# Altium schematic sheet MultiRotor.SchDoc
size A4
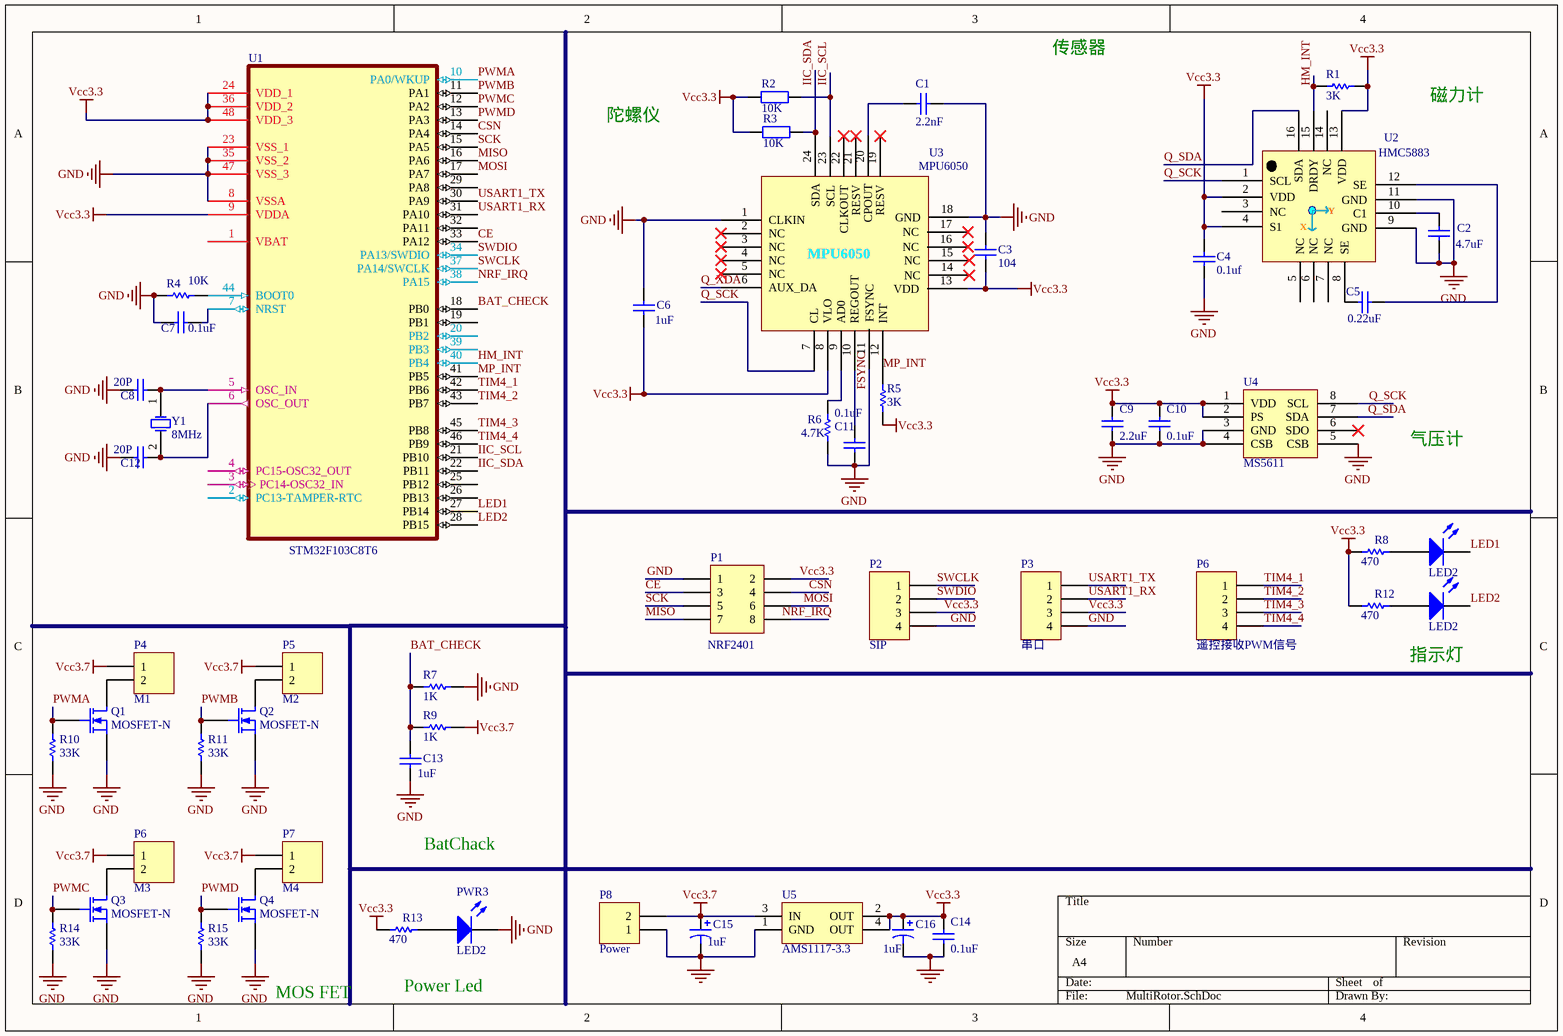
[diagram p0: MultiRotor.SchDoc]

## Parts
(Parts that share a designator on the sheet are numbered #1, #2 ... from top to bottom, then left to right.)
C1  value 2.2nF  [CAP[0805]]  (hidden comment: Cap)
C2  value 4.7uF  [CAP[0805]]  (hidden comment: Cap)
C3  value 104  [CAP[0805]]  (hidden comment: Cap)
C4  value 0.1uf  [CAP[0805]]  (hidden comment: Cap)
C5  value 0.22uF  [CAP[0805]]  (hidden comment: Cap)
C6  value 1uF  [CAP[0805]]  (hidden comment: Cap)
C7  value 0.1uF  [RAD-0.3]  (hidden comment: Cap)
C8  value 20P  [RAD-0.3]  (hidden comment: Cap)
C9  value 2.2uF  [CAP[0805]]  (hidden comment: Cap)
C10  value 0.1uF  [CAP[0805]]  (hidden comment: Cap)
C11  value 0.1uF  [CAP[0805]]  (hidden comment: Cap)
C12  value 20P  [RAD-0.3]  (hidden comment: Cap)
C13  value 1uF  [RAD-0.3]  (hidden comment: Cap)
C14  value 0.1uF  [RAD-0.3]  (hidden comment: Cap)
C15  value 1uF  [RB7.6-15]  (hidden comment: Cap Pol1)
C16  value 1uF  [RB7.6-15]  (hidden comment: Cap Pol1)
P1  NRF2401  [H2.54-2X4]
P2  SIP  [H2.54-1X4]
P3  串口  [H2.54-1X4]
P4  M1  [HDR1X2]
P5  M2  [HDR1X2]
P6#1  遥控接收PWM信号  [H2.54-1X4]
P6#2  M3  [HDR1X2]
P7  M4  [HDR1X2]
P8  Power  [H2.54-1X2]
PWR1  LED2  [3.2X1.6X1.1]
PWR2  LED2  [3.2X1.6X1.1]
PWR3  LED2  [3.2X1.6X1.1]
Q1  MOSFET-N  [E3]
Q2  MOSFET-N  [E3]
Q3  MOSFET-N  [E3]
Q4  MOSFET-N  [E3]
R1  value 3K  [AXIAL-0.3]  (hidden comment: Res1)
R2  value 10K  [CAP[0805]]  (hidden comment: Res2)
R3  value 10K  [CAP[0805]]  (hidden comment: Res2)
R4  value 10K  [AXIAL-0.3]  (hidden comment: Res1)
R5  value 3K  [AXIAL-0.3]  (hidden comment: Res1)
R6  value 4.7K  [AXIAL-0.3]  (hidden comment: Res1)
R7  value 1K  [AXIAL-0.3]  (hidden comment: Res1)
R8  value 470  [AXIAL-0.3]  (hidden comment: Res1)
R9  value 1K  [AXIAL-0.3]  (hidden comment: Res1)
R10  value 33K  [AXIAL-0.3]  (hidden comment: Res1)
R11  value 33K  [AXIAL-0.3]  (hidden comment: Res1)
R12  value 470  [AXIAL-0.3]  (hidden comment: Res1)
R13  value 470  [AXIAL-0.3]  (hidden comment: Res1)
R14  value 33K  [AXIAL-0.3]  (hidden comment: Res1)
R15  value 33K  [AXIAL-0.3]  (hidden comment: Res1)
U1  STM32F103C8T6  [Quad48]
U2  HMC5883
U3  MPU6050
U4  MS5611
U5  AMS1117-3.3  [ZZ311]
Y1  8MHz  [R38]

## Nets
FSYNC: C1.2 C2.2 C3.1 C4.1 C6.2 C7.2 C8.2 C9.1 C10.1 C11.2 C12.2 C13.1 C14.1 C15.2 C16.2 P1.1 P2.4 P3.4 P8.1 PWR3.2(K) Q1.3(S) Q2.3(S) Q3.3(S) Q4.3(S) R4.2 R6.2 R7.1 R10.1 R11.1 R14.1 R15.1 U1.8(VSSA) U1.23(VSS_1) U1.35(VSS_2) U1.47(VSS_3) U2.9(GND) U2.11(GND) U3.1(CLKIN) U3.11(FSYNC) U3.18(GND) U4.3(GND) U4.4(CSB) U4.5(CSB) U5.1(GND)  [also labelled GND]
Vcc3.3: C3.2 C4.2 C6.1 C9.2 C10.2 C14.2 C16.1 P1.2 P2.3 P3.3 R1.1 R2.2 R3.2 R5.1 R8.2 R12.2 R13.2 U1.9(VDDA) U1.24(VDD_1) U1.36(VDD_2) U1.48(VDD_3) U2.2(VDD) U2.4(S1) U2.13(VDD) U3.8(VLO) U3.13(VDD) U4.1(VDD) U4.2(PS) U5.2(OUT) U5.4(OUT)
Vcc3.7: C15.1 P4.1 P5.1 P6#2.1 P7.1 P8.2 R9.1 U5.3(IN)
BAT_CHECK: C13.2 R7.2 R9.2 U1.18(PB0)
CE: P1.3 U1.33(PA12)
CSN: P1.4 U1.14(PA4)
HM_INT: R1.2 U1.40(PB4) U2.15(DRDY)
IIC_SCL: R2.1 U1.21(PB10) U3.23(SCL)
IIC_SDA: R3.1 U1.22(PB11) U3.24(SDA)
LED1: PWR1.2(K) U1.27(PB14)
LED2: PWR2.2(K) U1.28(PB15)
MISO: P1.7 U1.16(PA6)
MOSI: P1.6 U1.17(PA7)
MP_INT: R5.2 U1.41(PB5) U3.12(INT)
NRF_IRQ: U1.38(PA15)
PWMA: Q1.2(G) R10.2 U1.10(PA0/WKUP)
PWMB: Q2.2(G) R11.2 U1.11(PA1)
PWMC: Q3.2(G) R14.2 U1.12(PA2)
PWMD: Q4.2(G) R15.2 U1.13(PA3)
Q_SCK: U2.1(SCL) U3.7(CL) U4.8(SCL)
Q_SDA: U2.16(SDA) U4.7(SDA)
Q_XDA: U3.6(AUX_DA)
SCK: P1.5 U1.15(PA5)
SWCLK: P2.1 U1.37(PA14/SWCLK)
SWDIO: P2.2 U1.34(PA13/SWDIO)
TIM4_1: P6#1.1 U1.42(PB6)
TIM4_2: P6#1.2 U1.43(PB7)
TIM4_3: P6#1.3 U1.45(PB8)
TIM4_4: P6#1.4 U1.46(PB9)
USART1_RX: P3.2 U1.31(PA10)
USART1_TX: P3.1 U1.30(PA9)
NetC1_1: C1.1 U3.20(CPOUT)
NetC2_1: C2.1 U2.10(C1)
NetC5_1: C5.1 U2.8(SE)
NetC5_2: C5.2 U2.12(SE)
NetC7_1: C7.1 U1.7(NRST)
NetC8_1: C8.1 U1.5(OSC_IN) Y1.1(OSC1)
NetC11_1: C11.1 U3.10(REGOUT)
NetC12_1: C12.1 U1.6(OSC_OUT) Y1.2(OSC2)
NetP4_2: P4.2 Q1.1(D)
NetP5_2: P5.2 Q2.1(D)
NetP6#2_2: P6#2.2 Q3.1(D)
NetP7_2: P7.2 Q4.1(D)
NetPWR1_1: PWR1.1(A) R8.1
NetPWR2_1: PWR2.1(A) R12.1
NetPWR3_1: PWR3.1(A) R13.1
NetR4_1: R4.1 U1.44(BOOT0)
NetR6_1: R6.1 U3.9(AD0)

Not connected (* = marked no-connect by the designer): P1 8; U1 1(VBAT) 2(PC13-TAMPER-RTC) 3(PC14-OSC32_IN) 4(PC15-OSC32_OUT) 19(PB1) 20(PB2) 25(PB12) 26(PB13) 29(PA8) 32(PA11) 39(PB3); U2 3(NC) 5(NC) 6(NC) 7(NC) 14(NC); U3 2(NC)* 3(NC)* 4(NC)* 5(NC)* 14(NC)* 15(NC)* 16(NC)* 17(NC)* 19(RESV)* 21(RESV)* 22(CLKOUT)*; U4 6(SDO)*

## Notes on the sheet
- 传感器
- 磁力计
- 陀螺仪
- 气压计
- 指示灯
- BatChack
- MOS FET
- Power Led
- Labels drawn without touching a wire or pin: NRF_IRQ
- (in symbol HMC5883) Y; X

## Library data of the parts
C1-C14 = Cap: Capacitor; Published: 8-Jun-2000; LatestRevisionDate: 17-Jul-2002; LatestRevisionNote: Re-released for DXP Platform.; Publisher: Altium Limited
  C1-C6 C9-C11: PackageReference: RAD-0.3
  C7 C8 C12 C13: PackageReference: RAD-0.3; PackageDescription: Radial Cap, Thru-Hole; 2 Leads; 0.3 in Pin Spacing
C15 C16 = Cap Pol1: Polarized Capacitor (Radial); Published: 8-Jun-2000; LatestRevisionDate: 17-Jul-2002; LatestRevisionNote: Re-released for DXP Platform.; Publisher: Altium Limited
P1 = Header 4X2: Header, 4-Pin, Dual row; LatestRevisionDate: 17-Jul-2002; LatestRevisionNote: Re-released for DXP Platform.; Publisher: Altium Limited
P2 P3 P6#1 = Header 4: Header, 4-Pin; LatestRevisionDate: 17-Jul-2002; LatestRevisionNote: Re-released for DXP Platform.; Publisher: Altium Limited
P4 P5 P6#2 P7 P8 = Header 2: Header, 2-Pin; LatestRevisionDate: 17-Jul-2002; LatestRevisionNote: Re-released for DXP Platform.; Publisher: Altium Limited
PWR1-PWR3 = LED2: Typical RED, GREEN, YELLOW, AMBER GaAs LED; Published: 8-Jun-2000; LatestRevisionDate: 17-Jul-2002; LatestRevisionNote: Re-released for DXP Platform.; PackageVersion: Feb-2002; PackageReference: 3.2X1.6X1.1; Publisher: Altium Limited; PackageDescription: SM LED; 2 Flat Leads
Q1-Q4 = MOSFET-N: N-Channel MOSFET; Published: 8-Jun-2000; LatestRevisionDate: 17-Jul-2002; LatestRevisionNote: Re-released for DXP Platform.; PackageVersion: 1995/1996; PackageReference: E3; Publisher: Altium Limited; PackageDescription: TO, Flat Index; 3 In-Line, Axial Leads; Body Dia. 4.6mm; Lead Dia. 0.5 mm (max)
R1 R4-R15 = Res1: Resistor; Published: 8-Jun-2000; LatestRevisionDate: 17-Jul-2002; LatestRevisionNote: Re-released for DXP Platform.; PackageReference: AXIAL-0.3; Publisher: Altium Limited; PackageDescription: Axial Device, Thru-Hole; 2 Leads; 0.3 in Pin Spacing
R2 R3 = Res2: Resistor; Published: 8-Jun-2000; LatestRevisionDate: 17-Jul-2002; LatestRevisionNote: Re-released for DXP Platform.; PackageReference: AXIAL-0.4; Publisher: Altium Limited
U1 = STM32F103C8T6: STM32 ARM-based 32-bit MCU with 64 Kbytes Flash, 48-pin LQFP, Industrial Temperature; Published: *; DatasheetVersion: *; PackageVersion: *; PackageReference: *; Publisher: *; PackageDescription: *; ComponentLink1Description: *; ComponentLink1URL: *; ComponentLink2Description: *; ComponentLink2URL: *
U5 = REG1117-3.3: 800mA and 1A Low Dropout Positive Regulator 2.85V, 3.3V, 5V, and Adjustable; PackageDocument: revC; Published: 8-Jun-2000; LatestRevisionDate: 17-Jul-2002; LatestRevisionNote: Re-released for DXP Platform.; DatasheetDocument: Sep-1997; PackageReference: ZZ311; Publisher: Altium Limited
Y1 = XTAL: Crystal Oscillator; Published: 8-Jun-2000; LatestRevisionDate: 17-Jul-2002; LatestRevisionNote: Re-released for DXP Platform.; PackageReference: R38; Publisher: Altium Limited; PackageDescription: Crystal, Thru-Hole; 2 Leads; Body 3.1 x 8.2 mm (Dia.xH)